# Altium schematic sheet Main.SchDoc
size A3
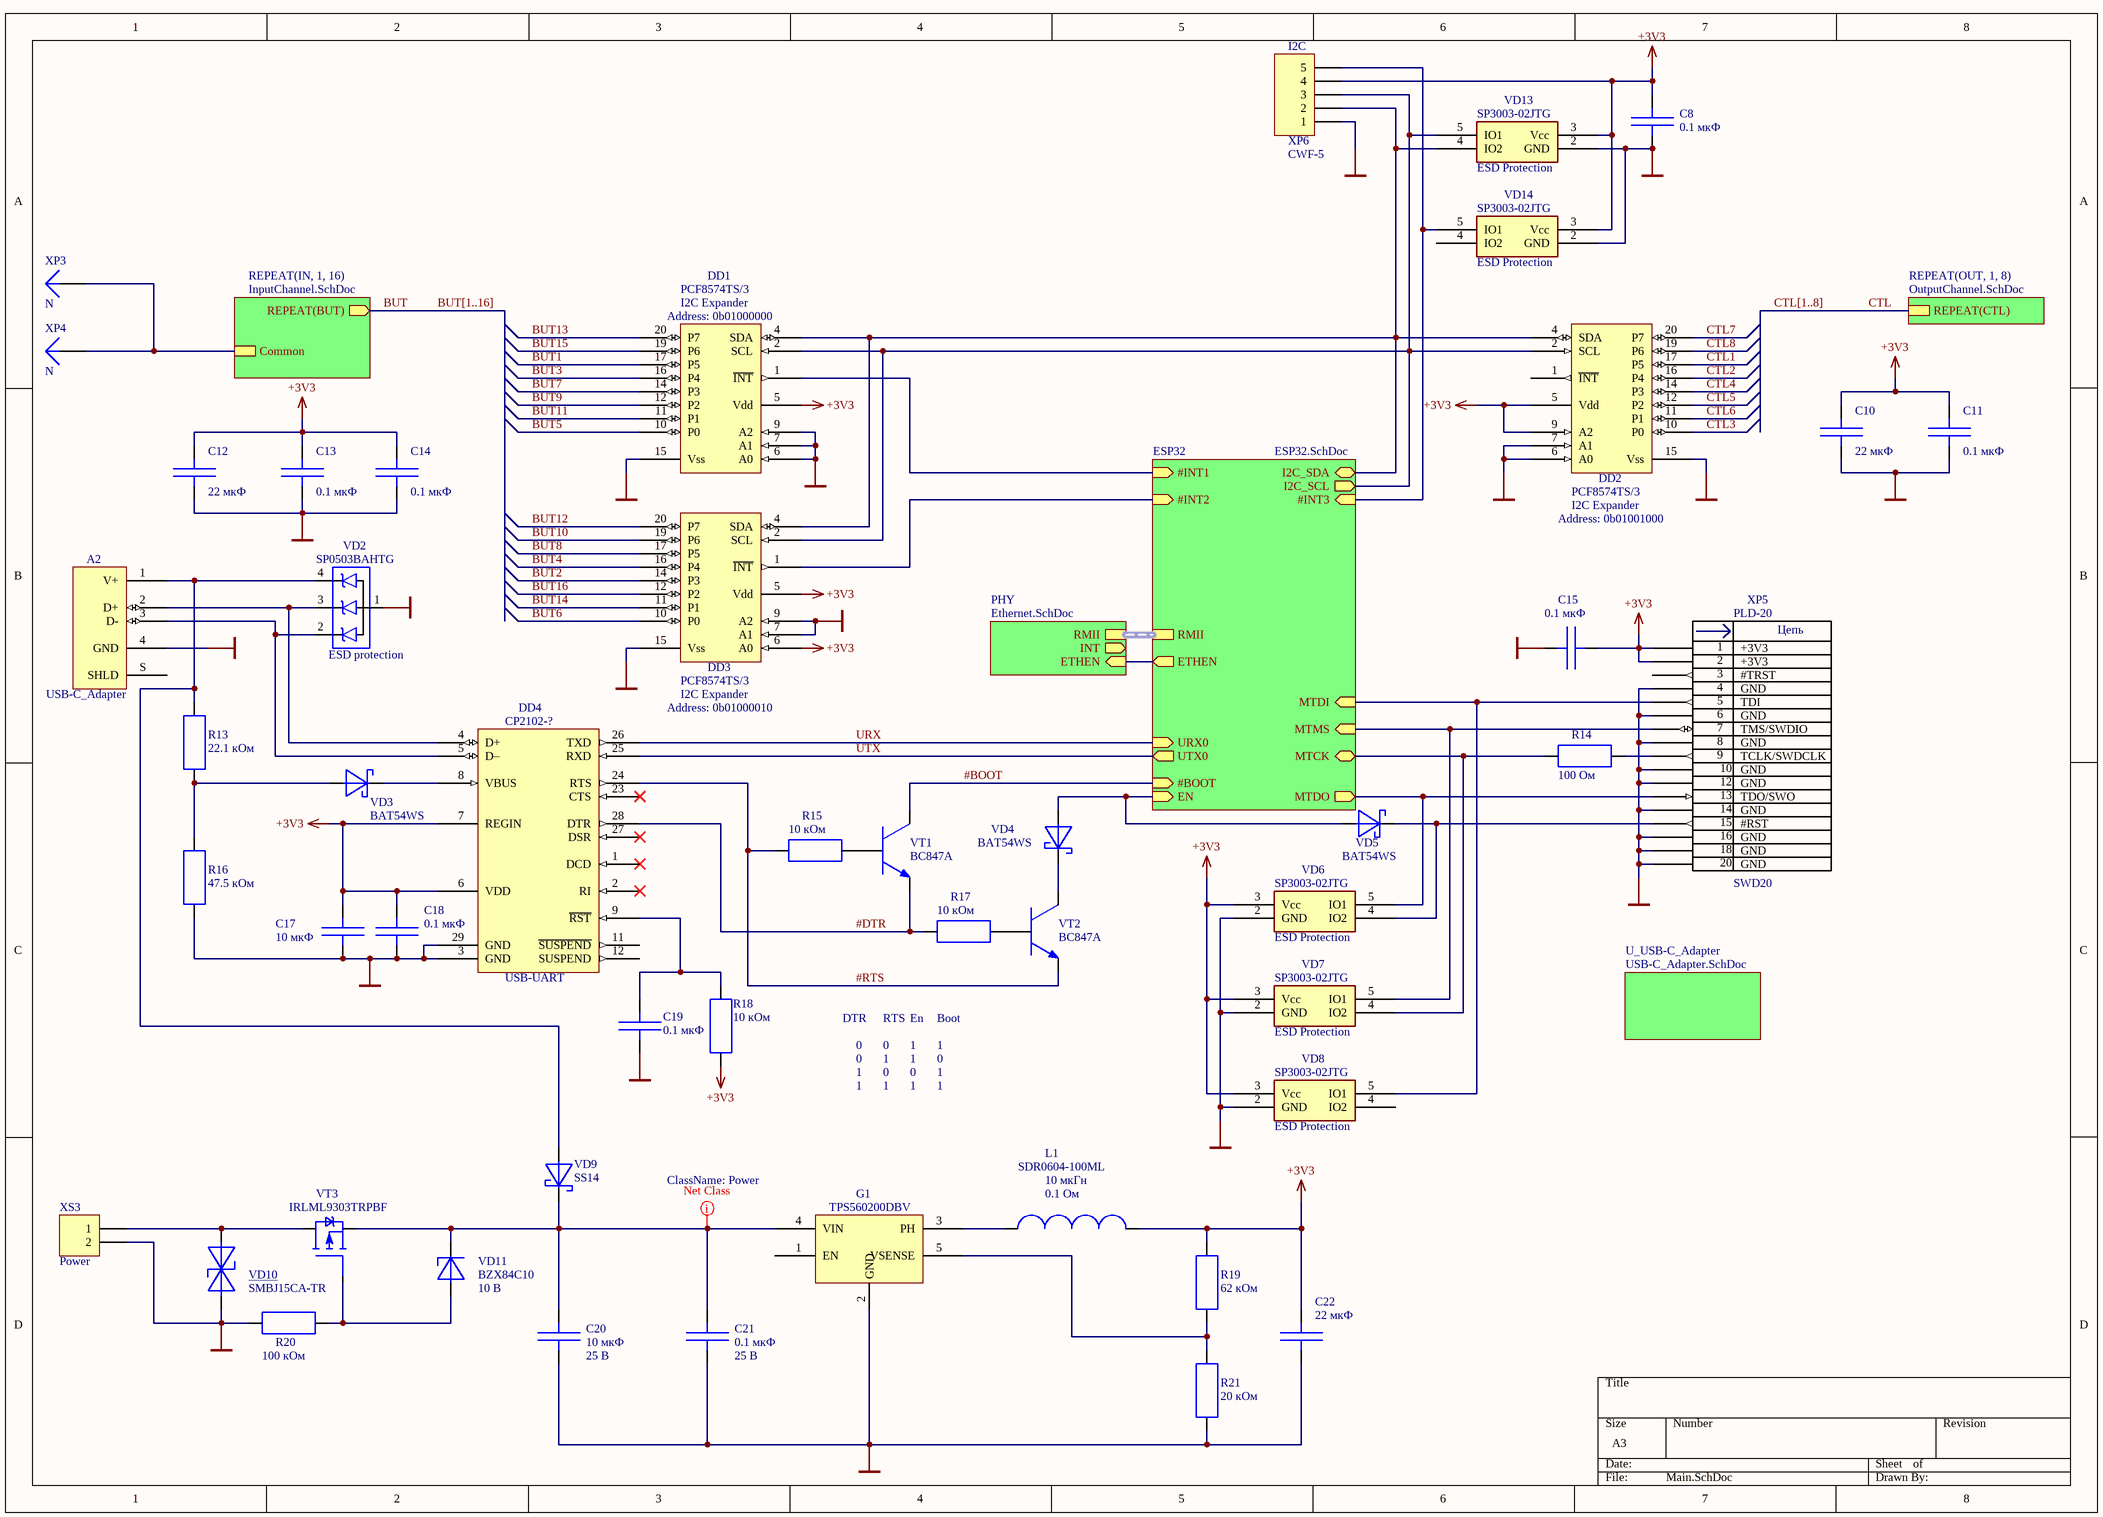
[diagram p0: Main.SchDoc]

## Parts
A2  USB-C_Adapter  [Usb-C_Adapter]  (no BOM)
C8  value 0.1 мкФ  [CAP_0603-1608]  (hidden comment: Cap)
C10  value 22 мкФ  [CAP_0805-2012]  (hidden comment: Cap)
C11  value 0.1 мкФ  [CAP_0603-1608]  (hidden comment: Cap)
C12  value 22 мкФ  [CAP_0805-2012]  (hidden comment: Cap)
C13  value 0.1 мкФ  [CAP_0603-1608]  (hidden comment: Cap)
C14  value 0.1 мкФ  [CAP_0603-1608]  (hidden comment: Cap)
C15  value 0.1 мкФ  [CAP_0603-1608]  (hidden comment: Cap)
C17  value 10 мкФ  [CAP_0603-1608]  (hidden comment: Cap)
C18  value 0.1 мкФ  [CAP_0603-1608]  (hidden comment: Cap)
C19  value 0.1 мкФ  [CAP_0603-1608]  (hidden comment: Cap)
C20  value 10 мкФ  Voltage: 25 В  [CAP_1206-3216]  (hidden comment: Cap)
C21  value 0.1 мкФ  Voltage: 25 В  [CAP_0805-2012]  (hidden comment: Cap)
C22  value 22 мкФ  [CAP_1206-3216]  (hidden comment: Cap)
DD1  I2C Expander  Address: 0b01000000  [TSSOP-0.65-20]
DD2  I2C Expander  Address: 0b01001000  [TSSOP-0.65-20]
DD3  I2C Expander  Address: 0b01000010  [TSSOP-0.65-20]
DD4  USB-UART  Type: CP2102-?  [QFN-0.5-28]
G1  Type: TPS560200DBV  [SOT-23-5]  (hidden comment: DC/DC converter)
L1  value 10 мкГн  Type: SDR0604-100ML  Resistance: 0.1 Ом  [SDR0604]  (hidden comment: Inductor)
R13  value 22.1 кОм  [RES_0603-1608]  (hidden comment: Res)
R14  value 100 Ом  [RES_0603-1608]  (hidden comment: Res)
R15  value 10 кОм  [RES_0603-1608]  (hidden comment: Res)
R16  value 47.5 кОм  [RES_0603-1608]  (hidden comment: Res)
R17  value 10 кОм  [RES_0603-1608]  (hidden comment: Res)
R18  value 10 кОм  [RES_0603-1608]  (hidden comment: Res)
R19  value 62 кОм  [RES_0603-1608]  (hidden comment: Res)
R20  value 100 кОм  [RES_0603-1608]  (hidden comment: Res)
R21  value 20 кОм  [RES_0603-1608]  (hidden comment: Res)
VD2  ESD protection  [SOT143_343127P600-8N]
VD3  Type: BAT54WS  [SOD-323]  (hidden comment: Diode_Schottky)
VD4  Type: BAT54WS  [SOD-323]  (hidden comment: Diode_Schottky)
VD5  Type: BAT54WS  [SOD-323]  (hidden comment: Diode_Schottky)
VD6  ESD Protection  Type: SP3003-02JTG  [SC70-5]
VD7  ESD Protection  Type: SP3003-02JTG  [SC70-5]
VD8  ESD Protection  Type: SP3003-02JTG  [SC70-5]
VD9  Type: SS14  [Diode_SMA]  (hidden comment: Diode_Schottky)
VD10  Type: SMBJ15CA-TR  [Diode_SMB_NP]  (hidden comment: Diode_TVS)
VD11  Type: BZX84C10  Voltage: 10 В  [SOT-23-3]  (hidden comment: Diode_Zener)
VD13  ESD Protection  Type: SP3003-02JTG  [SC70-5]
VD14  ESD Protection  Type: SP3003-02JTG  [SC70-5]
VT1  Type: BC847A  [SOT-23-3]  (hidden comment: Transistor_NPN)
VT2  Type: BC847A  [SOT-23-3]  (hidden comment: Transistor_NPN)
VT3  Type: IRLML9303TRPBF  [SOT-23-3]  (hidden comment: Transistor_P-MOSFET_Enh_Bulk_Shot)
XP3  N  [EK508V_Pin]
XP4  N  [EK508V_Pin]
XP5  SWD20  Type: PLD-20  [IDC-20MS]
XP6  I2C  [CWF-5]
XS3  Power  [DS-261]

## Sub-sheets
ESP32 = ESP32.SchDoc: #BOOT (in), EN (in), UTX0 (out), URX0 (in), MTMS (in), MTDO (out), MTDI (in), MTCK (bidir), #INT1 (in), I2C_SDA (bidir), I2C_SCL (out), #INT2 (in), RMII (harness RMII), ETHEN (out), #INT3 (in)
PHY = Ethernet.SchDoc: RMII (harness RMII), INT (out), ETHEN (in)
REPEAT(IN, 1, 16) = InputChannel.SchDoc: REPEAT(BUT) (out), Common
REPEAT(OUT, 1, 8) = OutputChannel.SchDoc: REPEAT(CTL)
U_USB-C_Adapter = USB-C_Adapter.SchDoc: no entries

## Nets
+3V3: C8.2 C10.2 C11.2 C12.2 C13.2 C14.2 C15.1 C17.2 C18.2 C22.2 DD1.5(Vdd) DD2.5(Vdd) DD2.9(A2) DD3.5(Vdd) DD3.6(A0) DD4.6(VDD) DD4.7(REGIN) L1.2 R18.1 R19.1 VD6.3(Vcc) VD7.3(Vcc) VD8.3(Vcc) VD13.3(Vcc) VD14.3(Vcc) XP5.1(+3V3) XP5.2(+3V3) XP6.4
GND: A2.4(GND) C8.1 C10.1 C11.1 C12.1 C13.1 C14.1 C15.2 C17.1 C18.1 C19.1 C20.1 C21.1 C22.1 DD1.6(A0) DD1.7(A1) DD1.9(A2) DD1.15(Vss) DD2.6(A0) DD2.7(A1) DD2.15(Vss) DD3.7(A1) DD3.9(A2) DD3.15(Vss) DD4.3(GND) DD4.29(GND) G1.2(GND) R16.1 R20.2 R21.2 VD2.1(A) VD6.2(GND) VD7.2(GND) VD8.2(GND) VD10.1(A) VD13.2(GND) VD14.2(GND) XP5.4(GND) XP5.6(GND) XP5.8(GND) XP5.10(GND) XP5.12(GND) XP5.14(GND) XP5.16(GND) XP5.18(GND) XP5.20(GND) XP6.1 XS3.2
#BOOT: VT1.3(C) ; sheet ESP32/#BOOT
#DTR: DD4.28(DTR) R17.1 VT1.2(E)
#RTS: DD4.24(RTS) R15.1 VT2.2(E)
BUT: sheet REPEAT(IN, 1, 16)/REPEAT(BUT)
BUT1: DD1.17(P5)
BUT2: DD3.14(P3)
BUT3: DD1.16(P4)
BUT4: DD3.16(P4)
BUT5: DD1.10(P0)
BUT6: DD3.10(P0)
BUT7: DD1.14(P3)
BUT8: DD3.17(P5)
BUT9: DD1.12(P2)
BUT10: DD3.19(P6)
BUT11: DD1.11(P1)
BUT12: DD3.20(P7)
BUT13: DD1.20(P7)
BUT14: DD3.11(P1)
BUT15: DD1.19(P6)
BUT16: DD3.12(P2)
CTL: sheet REPEAT(OUT, 1, 8)/REPEAT(CTL)
CTL1: DD2.17(P5)
CTL2: DD2.16(P4)
CTL3: DD2.10(P0)
CTL4: DD2.14(P3)
CTL5: DD2.12(P2)
CTL6: DD2.11(P1)
CTL7: DD2.20(P7)
CTL8: DD2.19(P6)
URX: DD4.26(TXD) ; sheet ESP32/URX0
UTX: DD4.25(RXD) ; sheet ESP32/UTX0
NetA2_1: A2.1(V+) R13.2 VD2.4(K3) VD9.1(A)
NetA2_2: A2.2(D+) DD4.4(D+) VD2.3(K2)
NetA2_3: A2.3(D-) DD4.5(D–) VD2.2(K1)
NetC19_2: C19.2 DD4.9(~{RST}) R18.2
NetC20_2: C20.2 C21.2 G1.4(VIN) VD9.2(K) VD11.2(K) VT3.2(S)
NetDD1_1: DD1.1(~{INT}) ; sheet ESP32/#INT1
NetDD1_2: DD1.2(SCL) DD2.2(SCL) DD3.2(SCL) VD13.5(IO1) XP6.3 ; sheet ESP32/I2C_SCL
NetDD1_4: DD1.4(SDA) DD2.4(SDA) DD3.4(SDA) VD13.4(IO2) XP6.2 ; sheet ESP32/I2C_SDA
NetDD3_1: DD3.1(~{INT}) ; sheet ESP32/#INT2
NetDD4_8: DD4.8(VBUS) VD3.2(K)
NetG1_3: G1.3(PH) L1.1
NetG1_5: G1.5(VSENSE) R19.2 R21.1
NetR13_1: R13.1 R16.2 VD3.1(A)
NetR14_1: R14.1 XP5.9(TCLK/SWDCLK)
NetR14_2: R14.2 VD7.4(IO2) ; sheet ESP32/MTCK
NetR15_2: R15.2 VT1.1(B)
NetR17_2: R17.2 VT2.1(B)
NetR20_1: R20.1 VD11.1(A) VT3.1(G)
NetVD4_1: VD4.1(A) VD5.1(A) ; sheet ESP32/EN
NetVD4_2: VD4.2(K) VT2.3(C)
NetVD5_2: VD5.2(K) VD6.4(IO2) XP5.15(#RST)
NetVD6_5: VD6.5(IO1) XP5.13(TDO/SWO) ; sheet ESP32/MTDO
NetVD7_5: VD7.5(IO1) XP5.7(TMS/SWDIO) ; sheet ESP32/MTMS
NetVD8_5: VD8.5(IO1) XP5.5(TDI) ; sheet ESP32/MTDI
NetVD10_2: VD10.2(K) VT3.3(D) XS3.1
NetVD14_5: VD14.5(IO1) XP6.5 ; sheet ESP32/#INT3
NetXP3_1: XP3.1 XP4.1 ; sheet REPEAT(IN, 1, 16)/Common
(unnamed): sheet ESP32/ETHEN, sheet PHY/ETHEN

Not connected (* = marked no-connect by the designer): A2 S(SHLD); DD1 3(NC) 8(NC) 13(NC) 18(NC); DD2 1(~{INT}) 3(NC) 8(NC) 13(NC) 18(NC); DD3 3(NC) 8(NC) 13(NC) 18(NC); DD4 1(DCD)* 2(RI)* 10(NC) 11(~{SUSPEND}) 12(SUSPEND) 13(NC) 14(NC) 15(NC) 16(NC) 17(NC) 18(NC) 19(NC) 20(NC) 21(NC) 22(NC) 23(CTS)* 27(DSR)*; G1 1(EN); VD6 1(NC); VD7 1(NC); VD8 1(NC) 4(IO2); VD13 1(NC); VD14 1(NC) 4(IO2); XP5 3(#TRST) 11(NC) 17(NC) 19(NC)

## Buses and harness runs
bus BUT[1..16]
bus CTL[1..8]
harness sheet ESP32/RMII = sheet PHY/RMII

## Layout directives
net class Power: NetC20_2

## Notes on the sheet
- DTR
- 0
- RTS
- 1
- En
- Boot
- (in symbol SWD20) Цепь

## Library data of the parts
C8 = Cap: ЧИП конденсатор керамический; Voltage: 50 В; Type: GRM188R71H104K; Dielectric: X7R; Tolerance: 10%; BomGroup: Конденсаторы; BomTitle: Конденсатор керамический SMD; Case: 0603
C10 C12 = Cap: Конденсатор; Voltage: 6.3 В; Type: GRM21BR60J226M; Dielectric: X5R; BomGroup: Конденсаторы; BomTitle: Конденсатор керамический SMD; Case: 0805
C11 C13-C15 C18 C19 = Cap: Конденсатор; Voltage: 50 В; Type: GRM188R71H104K; Dielectric: X7R; BomGroup: Конденсаторы; BomTitle: Конденсатор керамический SMD; Case: 0603
C17 = Cap: ЧИП конденсатор керамический; Voltage: 6.3 В; Type: GRM188R60J106ME47D; Dielectric: X5R; Tolerance: 10%; BomGroup: Конденсаторы; BomTitle: Конденсатор керамический SMD; Case: 0603
C20 = Cap: ЧИП конденсатор керамический; Type: GRM31CR71E106KA12L; Dielectric: X5R; Tolerance: 10%; BomGroup: Конденсаторы; BomTitle: Конденсатор керамический SMD; Case: 1206
C21 = Cap: ЧИП конденсатор керамический; Type: GRM21BR71E104KA01L; Dielectric: X7R; Tolerance: 10%; BomGroup: Конденсаторы; BomTItle: Конденсатор керамический SMD; Case: 0805
C22 = Cap: ЧИП конденсатор керамический; Voltage: 16 В; Type: GRM31CR61C226ME15L; Dielectric: X5R; Tolerance: 20%; BomGroup: Конденсаторы; BomTitle: Конденсатор керамический SMD; Case: 1206
DD1-DD3 = PCF8574TS/3: Remote 8-bit I/O expander for I2C-bus with interrupt; BomGroup: Микросхемы; BomTitle: Микросхема; AddressTemplate: 0b0100xxx0; Type: PCF8574TS/3
DD4 = CP2102_QFN28: SINGLE-CHIP USB-TO-UART BRIDGE; BomGroup: Микросхемы; BomTitle: Микросхема
G1 = TPS560200: 4.5-V to 17-V Input, 500-mA Synchronous Step-Down Converter With  Advanced Eco-Mode; BomGroup: Микросхемы; BomTitle: Микросхема; Case: SOT23-5
L1 = Inductor: ЧИП катушка индуктивности; Tolerance: 20%; BomTitle: Индуктивность SMD; Case: SDR0604; BomGroup: Индуктивности
R13-R18 = Res: Резистор постоянный; Power: 0.125 W; Tolerance: 5%; BomGroup: Резисторы; BomTitle: Резистор SMD; Case: 0603
R19 = Res: ЧИП резистор постоянный; Power: 0.1 W; Tolerance: 1%; BomGroup: Резисторы; BomTitle: Резистор SMD; Case: 0603; Type: CRCW060362K0FK
R20 = Res: ЧИП резистор постоянный; Power: 0.1 W; Tolerance: 5%; BomGroup: Резисторы; BomTitle: Резистор SMD; Case: 0603
R21 = Res: ЧИП резистор постоянный; Tolerance: 1%; BomGroup: Резисторы; BomTitle: Резистор SMD; Case: 0603; Type: CRCW060320K0FKEA
VD2 = SP0503BAHTG: 3 Channel 30pF 30kV Unidirectional TVS Array; BomGroup: Микросхемы; BomTitle: Микросхема; Type: SP0503BAHTG
VD3-VD5 VD9 = Diode_Schottky: Диод Шоттки; BomGroup: Диоды; BomTitle: Диод Шоттки
  VD3-VD5: Case: SOD-323
  VD9: Case: SMA
VD6-VD8 VD13 VD14 = SP3003-02J: BomGroup: Микросхемы; BomTitle: Микросхема; Case: SC70-5
VD10 = Diode_TVS: Диод лавинный двуханодный (TVS, супрессор); BomGroup: Диоды; Case: SMB; BomTitle: Супрессор
VD11 = Diode_Zener: Диод лавинный выпрямительный (стабилитрон); pin to pad: 2>3; BomGroup: Диоды; Case: SOT-23-3; BomTitle: Стабилитрон
VT1 VT2 = Transistor_NPN: Транзистор биполярный NPN; BomGroup: Транзисторы; Case: SOT23-3; BomTitle: Транзистор биполярный
VT3 = Transistor_P-MOSFET_Enh_Bulk_Shot: P-канальный полевой транзистор с изолированным затвором обогащенного типа с соединением истока и подложки c диодом Шоттки; BomGroup: Транзисторы; BomTitle: Транзистор P-канальный; Case: SOT-23-3
XP3 XP4 = Plug: LatestRevisionDate: 17-Jul-2002; LatestRevisionNote: Re-released for DXP Platform.; Publisher: Altium Limited
XP5 = SWD20: SWD connector; BomGroup: Соединители; BomTitle: Соединитель штыревой
XP6 = Header 5: Header, 5-Pin; BomGroup: Соединители; BomTitle: Соединитель штыревой; Type: CWF-5
XS3 = Header 2: BomGroup: Соединители; BomTitle: Клеммник нажимной; Type: DG141V-2.54-02P